# EAGLE design mspfacedraft2 (EAGLE 9.6.2)
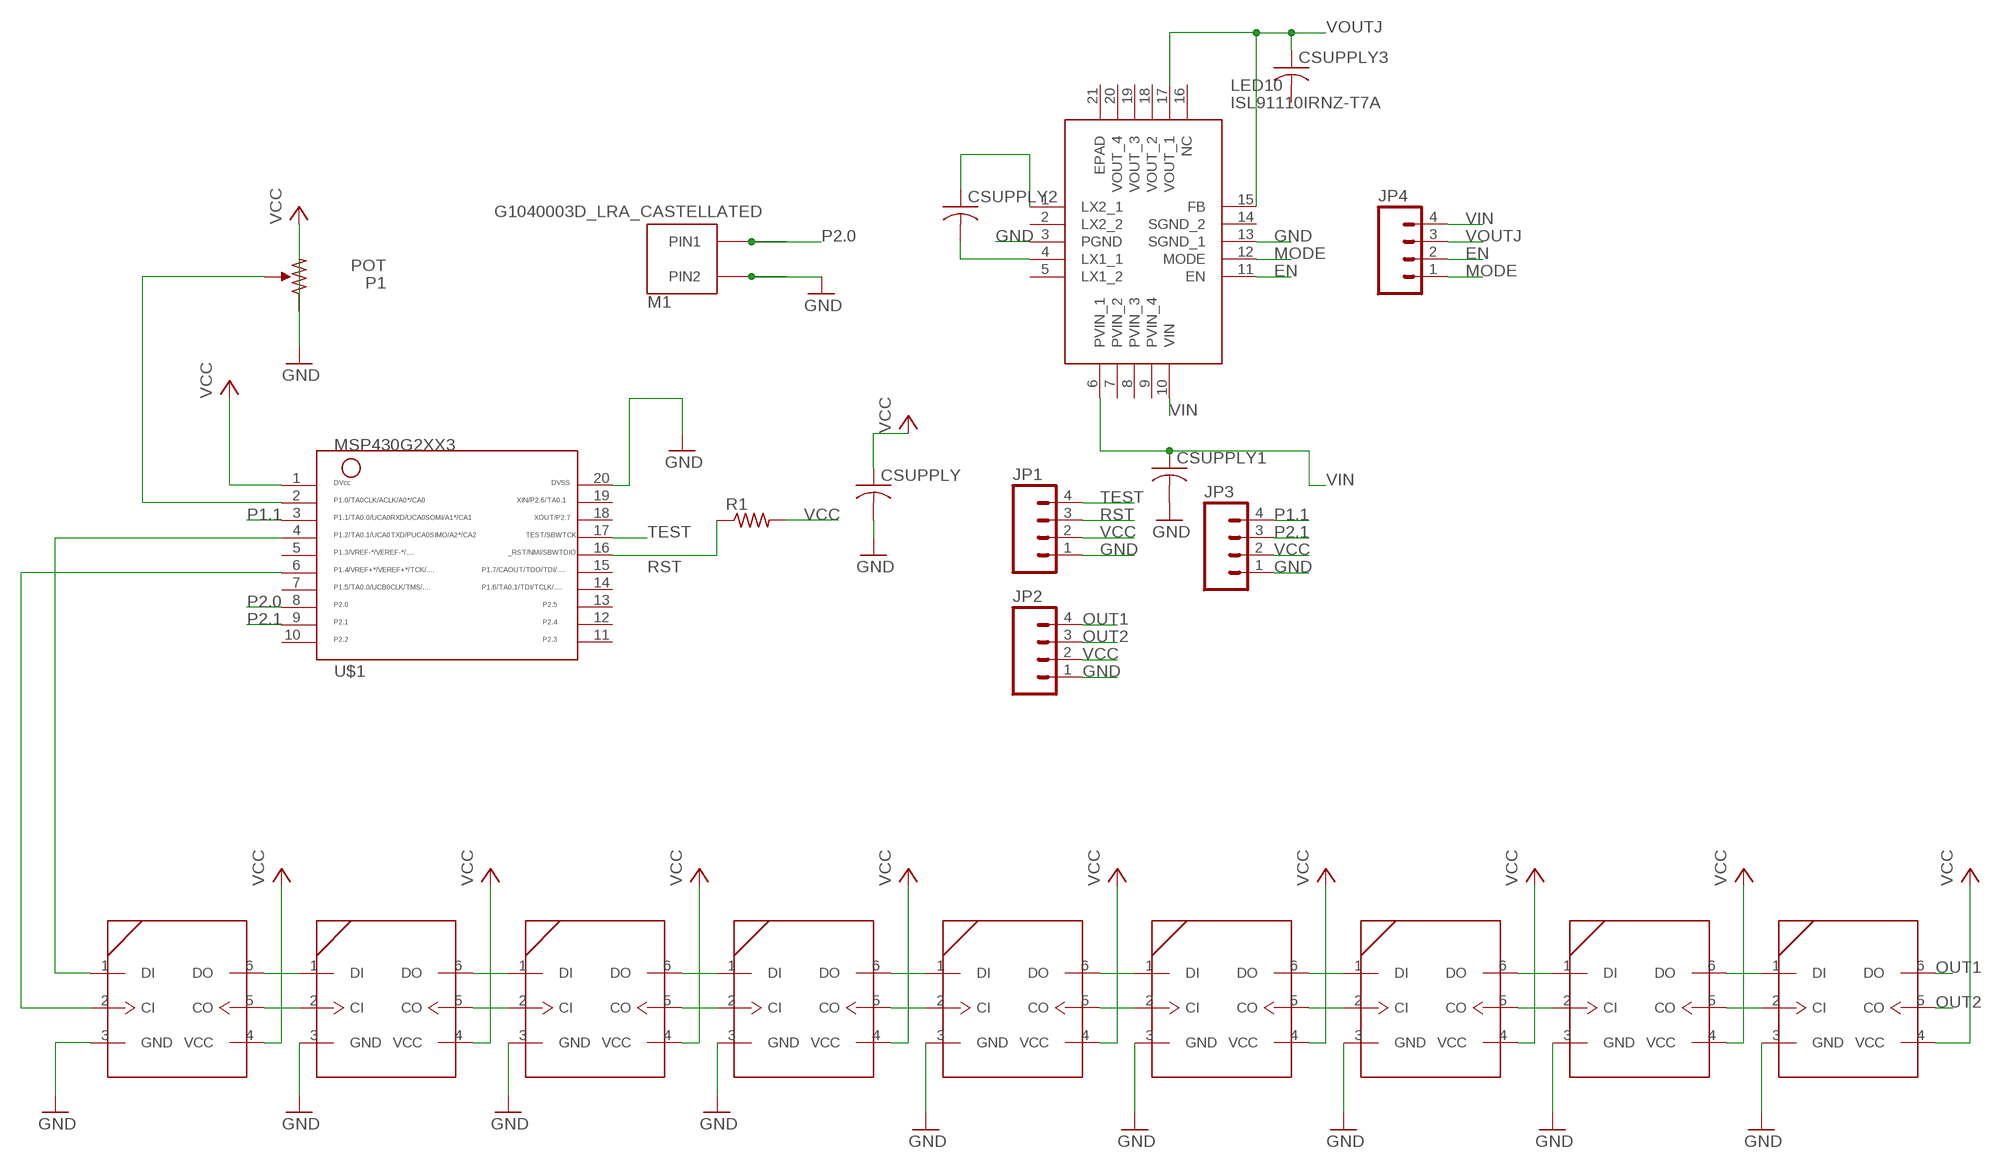
[diagram p0: schematic, sheet 1]

## Parts
CSUPPLY  C-USC1206  [C1206]
CSUPPLY1  C-USC1206  [C1206]
CSUPPLY2  C-USC1206  [C1206]
CSUPPLY3  C-USC1206  [C1206]
JP1  M04LOCK  [1X04_LOCK]
JP2  M04LOCK  [1X04_LOCK]
JP3  M04LOCK  [1X04_LOCK]
JP4  M04LOCK  [1X04_LOCK]
LED1  APA102  [5050]
LED2  APA102  [5050]
LED3  APA102  [5050]
LED4  APA102  [5050]
LED5  APA102  [5050]
LED6  APA102  [5050]
LED7  APA102  [5050]
LED8  APA102  [5050]
LED9  APA102  [5050]
LED10  ISL91110IRNZ-T7A  [QFN50P400X400X100-21N]
M1  G1040003D_LRA_CASTELLATED  [COIN_VIBRATION_MOTOR_CASTEL]
P1  POT  [POT]
R1  R-US_R1206  [R1206]
U$1  MSP430G2XX3TSSOP  [PW20]

## Nets
EN: JP4.2 LED10.11(EN)
GND: CSUPPLY1.2 CSUPPLY.2 JP1.1 JP2.1 JP3.1 LED1.3(GND) LED2.3(GND) LED3.3(GND) LED4.3(GND) LED5.3(GND) LED6.3(GND) LED7.3(GND) LED8.3(GND) LED9.3(GND) LED10.3(PGND) LED10.13(SGND_1) M1.P$2(PIN2) P1.GND(CW) U$1.20
MODE: JP4.1 LED10.12(MODE)
N$1: LED1.6(DO) LED2.1(DI)
N$2: LED1.5(CO) LED2.2(CI)
N$3: LED2.6(DO) LED3.1(DI)
N$4: LED2.5(CO) LED3.2(CI)
N$5: LED3.6(DO) LED4.1(DI)
N$6: LED3.5(CO) LED4.2(CI)
N$7: LED1.1(DI) U$1.4
N$8: LED1.2(CI) U$1.6
N$9: LED4.6(DO) LED5.1(DI)
N$10: LED4.5(CO) LED5.2(CI)
N$11: LED5.6(DO) LED6.1(DI)
N$12: LED5.5(CO) LED6.2(CI)
N$13: LED6.6(DO) LED7.1(DI)
N$14: LED6.5(CO) LED7.2(CI)
N$15: LED7.6(DO) LED8.1(DI)
N$16: LED7.5(CO) LED8.2(CI)
N$17: LED8.6(DO) LED9.1(DI)
N$18: LED8.5(CO) LED9.2(CI)
N$19: CSUPPLY2.2 LED10.4(LX1_1)
N$20: P1.SIG(S) U$1.2
N$21: CSUPPLY2.1 LED10.1(LX2_1)
OUT1: JP2.4 LED9.6(DO)
OUT2: JP2.3 LED9.5(CO)
P1.1: JP3.4 U$1.3
P2.0: M1.P$1(PIN1) U$1.8
P2.1: JP3.3 U$1.9
RST: JP1.3 R1.1 U$1.16
TEST: JP1.4 U$1.17
VCC: CSUPPLY.1 JP1.2 JP2.2 JP3.2 LED1.4(VCC) LED2.4(VCC) LED3.4(VCC) LED4.4(VCC) LED5.4(VCC) LED6.4(VCC) LED7.4(VCC) LED8.4(VCC) LED9.4(VCC) P1.VDD(CCW) R1.2 U$1.1
VIN: CSUPPLY1.1 JP4.4 LED10.6(PVIN_1) LED10.10(VIN)
VOUTJ: CSUPPLY3.1 JP4.3 LED10.15(FB) LED10.17(VOUT_1)
Unconnected: CSUPPLY3.2 LED10.2(LX2_2) LED10.5(LX1_2) LED10.7(PVIN_2) LED10.8(PVIN_3) LED10.9(PVIN_4) LED10.14(SGND_2) LED10.16(NC) LED10.18(VOUT_2) LED10.19(VOUT_3) LED10.20(VOUT_4) LED10.21(EPAD) U$1.5 U$1.7 U$1.10 U$1.11 U$1.12 U$1.13 U$1.14 U$1.15 U$1.18 U$1.19

## Library data of the parts
CSUPPLY CSUPPLY1-CSUPPLY3 = rcl:C-US: CAPACITOR, American symbol
JP1-JP4 = SparkFun:M04: Header 4 Standard 4-pin 0.1" header. Use with straight break away headers (SKU : PRT-00116), right angle break away headers (PRT-00553), swiss pins (PRT-00743), machine pins (PRT-00117), and female headers (PRT-00115). Molex polarized connector foot print use with SKU : PRT-08231 with associated crimp pins and housings. 1MM SMD Version SKU: PRT-10208
LED1-LED9 = ELEC327:APA102: APA102 SPI RGB LED APA102 is a chainable RGB LED. The control protocol is a variant of SPI.
LED10 = SamacSys_Parts:ISL91110IRNZ-T7A: Integrated FET Regulators High Current Buck Boost Switching Regulator Delivering 2A of Continuous Output Current Source: Datasheet <https://datasheet.datasheetarchive.com/originals/distributors/Datasheets_SAMA/d3e5c1b0a1d99c18e56c54f82b79d217.pdf>; DESCRIPTION: Integrated FET Regulators High Current Buck Boost Switching Regulator Delivering 2A of Continuous Output Current; HEIGHT: 1mm; MANUFACTURER_NAME: Renesas Electronics; MANUFACTURER_PART_NUMBER: ISL91110IRNZ-T7A; MOUSER_PART_NUMBER: 968-ISL91110IRNZ-T7A; MOUSER_PRICE-STOCK: https://www.mouser.co.uk/ProductDetail/Renesas-Intersil/ISL91110IRNZ-T7A?qs=vyIerDHf%2Fmmihws9YL5pdg%3D%3D
M1 = TEMP:G1040003D_LRA: G1040003D Coin Vibration Motor - Jinlong Machinery and Electronics Inc. LRA Coin Vibration Motor SparkFun Products: [PRODUCT 1] <[PRODUCT1LINK]>; PROD_ID: COMP-15536
P1 = pot:POT
R1 = resistor:R-US_: RESISTOR, American symbol
U$1 = ELEC327:MSP430G2XX3: MSP430G2XX3 PDIP (N) 20 Pin Package

## Board
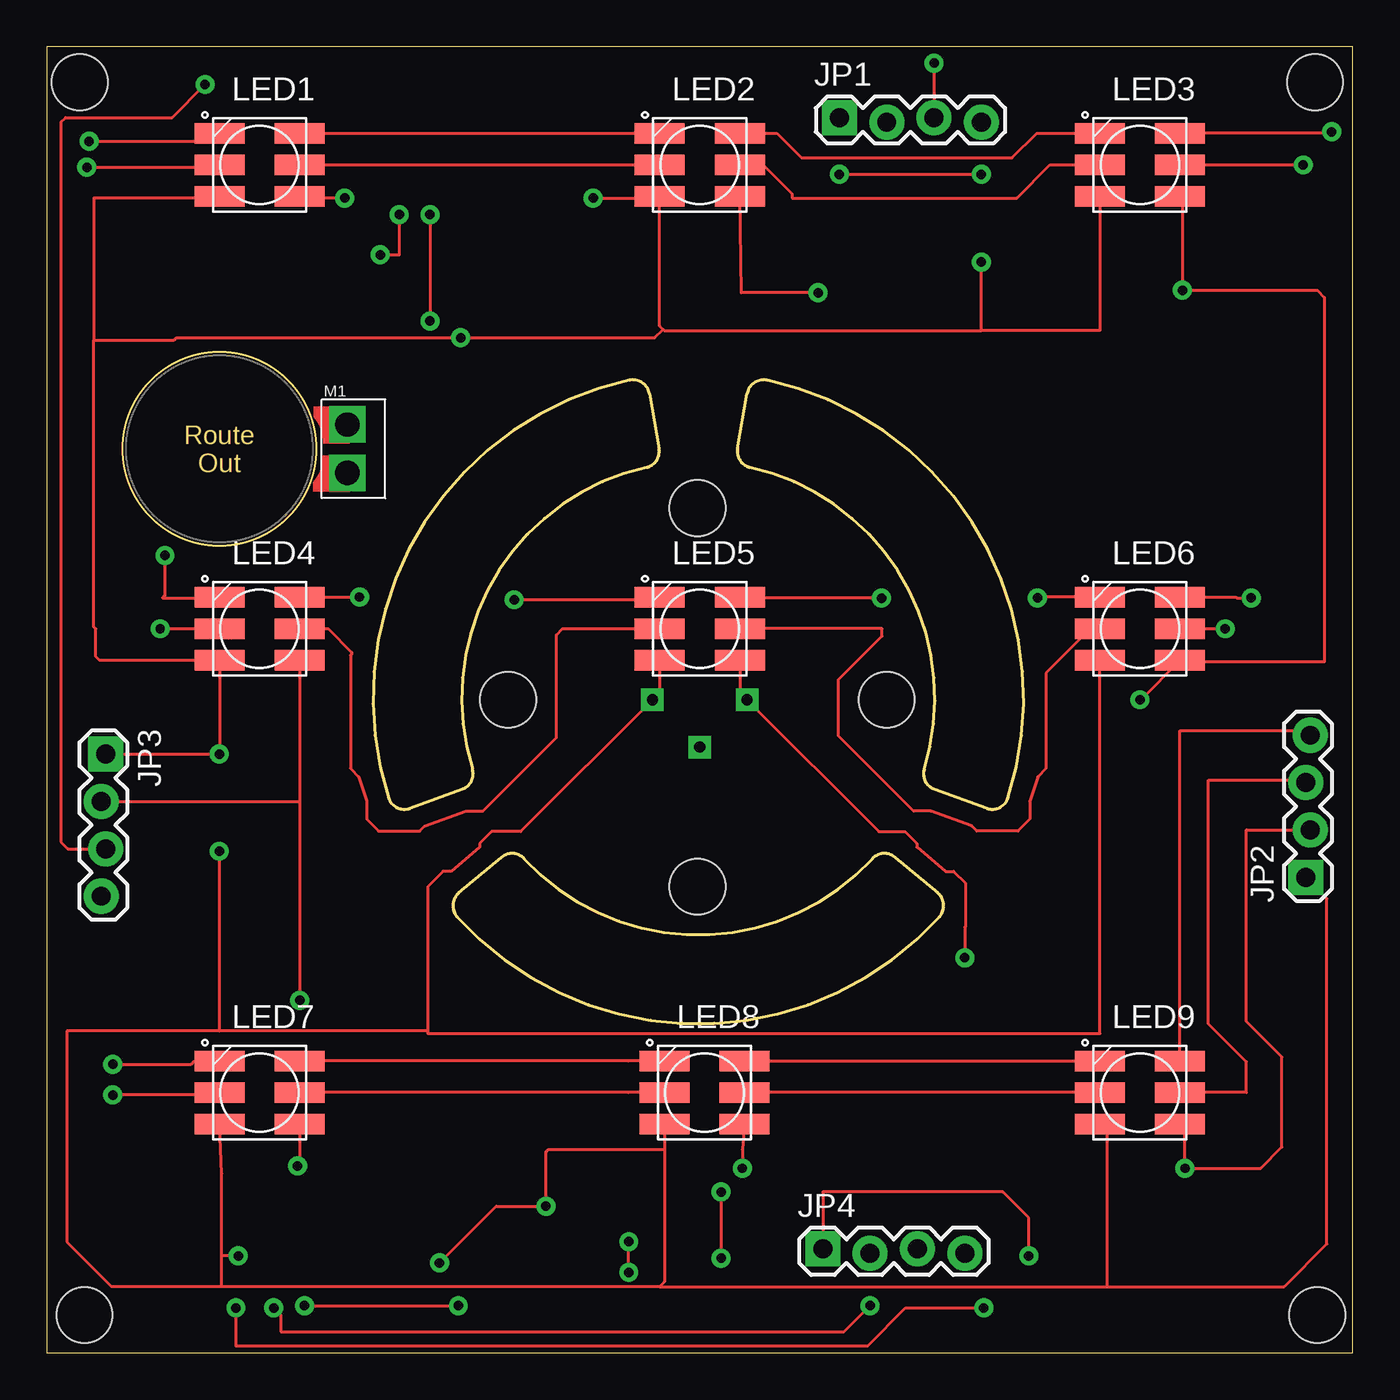
[diagram p1: board, top side]
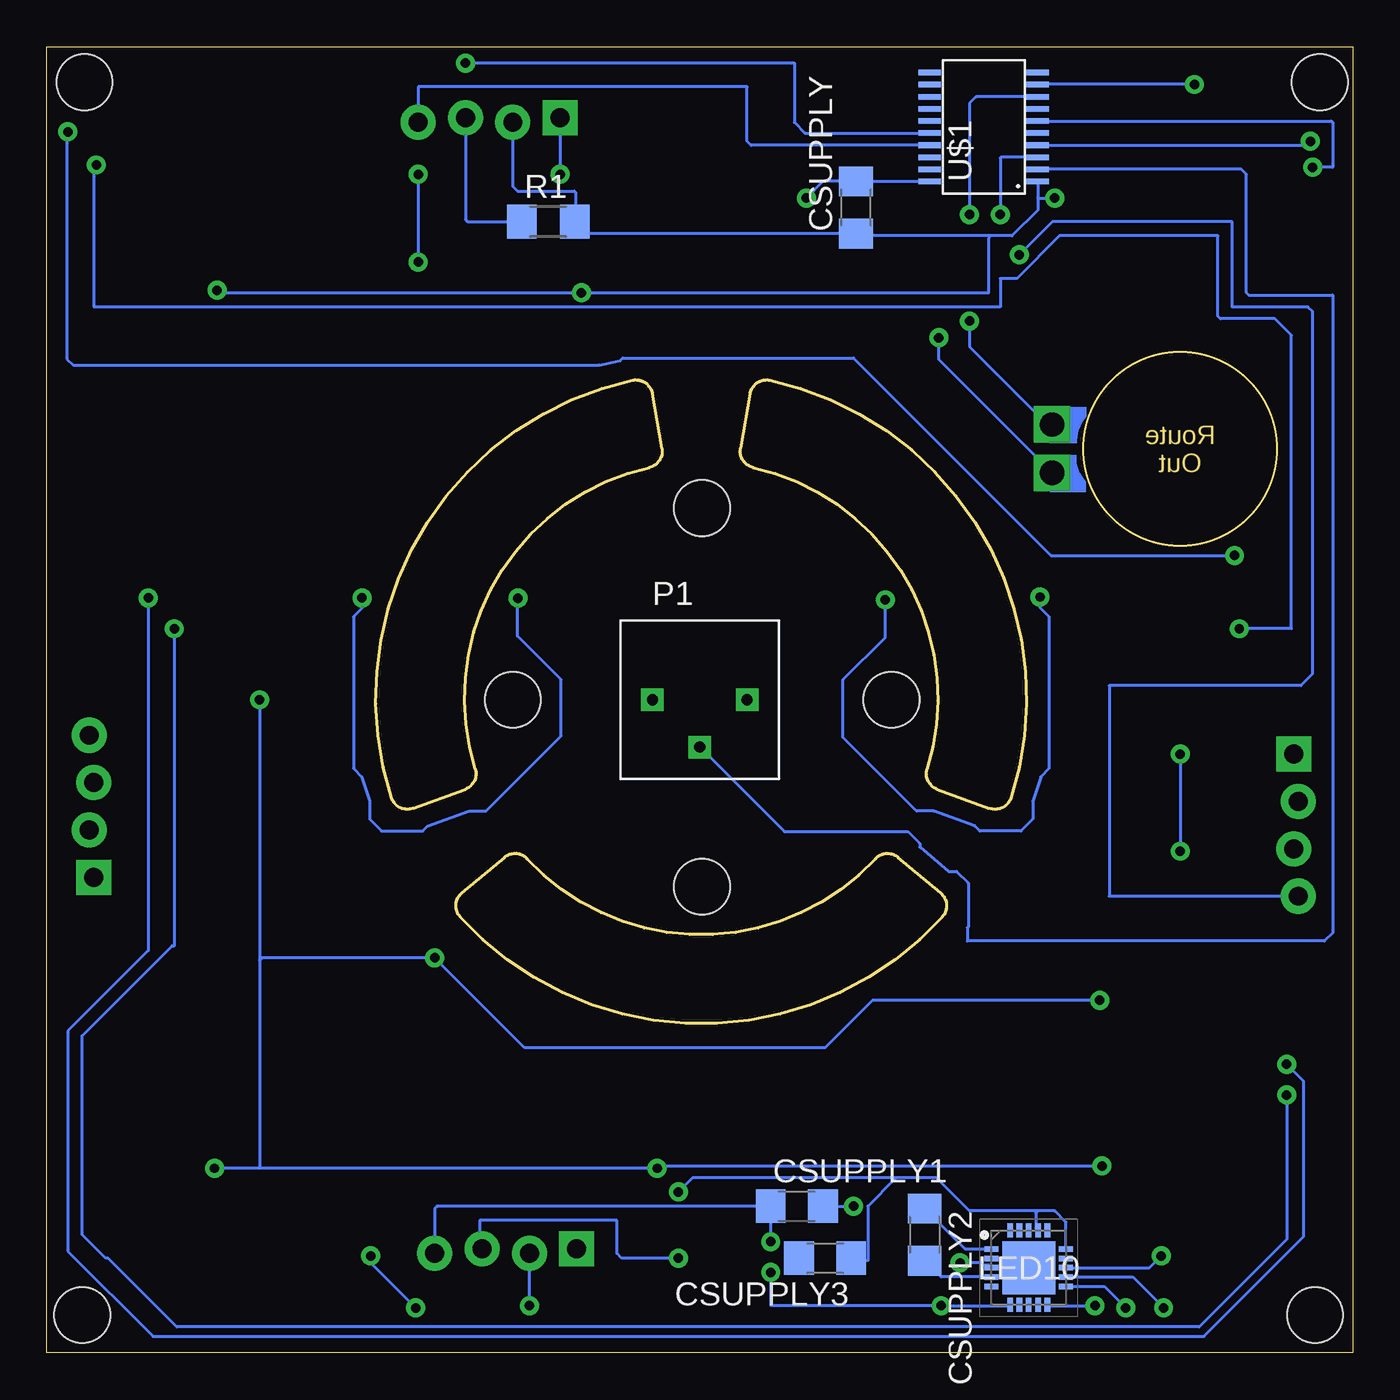
[diagram p2: board, bottom side, seen from below]

Size 70.1 x 70.1 mm. Coordinates in mm from the lower left corner, seen from the top.
Outline: 0,0 70.1,0 70.1,70.1 0,70.1 0,0
Outline: 50.45,29.23 arc92 51.6,29.79 arc96 38.66,52.2 arc92 37.6,51.48 37.08,48.54 arc87 37.76,47.52 arc-95 47.1,31.35 arc87 47.64,30.25 50.45,29.23
Outline: 32.35,51.48 arc92 31.28,52.2 arc96 18.35,29.79 arc92 19.5,29.23 22.3,30.25 arc87 22.85,31.35 arc-95 32.19,47.52 arc87 32.87,48.54 32.35,51.48
Outline: 22.12,24.68 arc92 22.04,23.4 arc96 47.91,23.4 arc92 47.82,24.68 45.53,26.6 arc87 44.31,26.52 arc-95 25.64,26.52 arc87 24.41,26.6 22.12,24.68
Copper layers (1*16): Top 0.035mm / dielectric 1.5mm / Bottom 0.035mm
Design rules "AdvancedCircuitsBarebones": minimum track width 6mil, minimum drill 20mil, track to track 6mil, track to pad 6mil, pad to pad 6mil, via to via 6mil, smd to smd 6mil, copper to edge 10mil, drill to drill 6mil, minimum pad ring 12mil, minimum via ring 10mil, stop-mask expansion 4mil, vias tented up to drill 25mil, thermal gap 10mil
Holes 3 mm at 34.92,25.02 24.77,35.05 34.92,45.34 45.09,35.05 68.07,68.2 1.78,68.2 2.03,2.03 68.2,2.03

### Footprints (pad centres in the part's own frame; a part is rotated, then mirrored left to right if it is on the bottom)
C1206 = smd 1.6 x 1.8: 1 -1.4,0; 2 1.4,0
1X04_LOCK = drill 1.016 pad 1.88 square: 1 0,0.127 | drill 1.016 pad 1.88: 2 2.54,-0.127; 3 5.08,0.127; 4 7.62,-0.127
5050 = smd 2.68 x 1.1: 1 -2.15,1.7; 2 -2.15,0; 3 -2.15,-1.7; 4 2.15,-1.7; 5 2.15,0; 6 2.15,1.7
QFN50P400X400X100-21N = smd 0.75 x 0.3: 1 -2,1; 2 -2,0.5; 3 -2,0; 4 -2,-0.5; 5 -2,-1; 11 2,-1; 12 2,-0.5; 13 2,0; 14 2,0.5; 15 2,1 | smd 0.3 x 0.75: 6 -1,-2; 7 -0.5,-2; 8 0,-2; 9 0.5,-2; 10 1,-2; 16 1,2; 17 0.5,2; 18 0,2; 19 -0.5,2; 20 -1,2 | smd 2.85 x 2.85: 21 0,0
COIN_VIBRATION_MOTOR_CASTEL = drill 1.3 square: P$1 6.87,1.31; P$2 6.87,-1.29
POT = drill 0.6 square: GND 2.54,0; SIG 0,-2.54; VDD -2.54,0
R1206 = smd 1.6 x 1.803: 1 -1.422,0; 2 1.422,0
PW20 = smd 0.3 x 1.2: 1 -2.925,-2.9; 2 -2.275,-2.9; 3 -1.625,-2.9; 4 -0.975,-2.9; 5 -0.325,-2.9; 6 0.325,-2.9; 7 0.975,-2.9; 8 1.625,-2.9; 9 2.275,-2.9; 10 2.925,-2.9; 11 2.925,2.9; 12 2.275,2.9; 13 1.625,2.9; 14 0.975,2.9; 15 0.325,2.9; 16 -0.325,2.9; 17 -0.975,2.9; 18 -1.625,2.9; 19 -2.275,2.9; 20 -2.925,2.9

### Placement (x,y rotation side)
CSUPPLY  26.67,61.47 90 bottom
CSUPPLY1  29.84,7.87 0 bottom
CSUPPLY2  22.99,6.35 270 bottom
CSUPPLY3  28.32,5.08 180 bottom
JP1  42.55,66.17 0 top
JP2  67.69,25.53 90 top
JP3  3.05,32.13 270 top
JP4  41.66,5.46 0 top
LED1  11.43,63.75 0 top
LED2  35.05,63.75 0 top
LED3  58.67,63.75 0 top
LED4  11.43,38.86 0 top
LED5  35.05,38.86 0 top
LED6  58.67,38.86 0 top
LED7  11.43,13.97 0 top
LED8  35.31,13.97 0 top
LED9  58.67,13.97 0 top
LED10  17.4,4.57 0 bottom
M1  9.27,48.51 0 top
P1  35.05,35.05 0 bottom
R1  43.18,60.71 0 bottom
U$1  19.81,65.79 90 bottom

### Tracks (layer width: path | path; a pad name or v marks a point on that pad's centre or on a via)
EN  (via drill 0.51)
  Top 0.152: v12.19,2.41 12.57,2.03 12.57,1.14 42.8,1.14 v44.2,2.54
  Bottom 0.152: LED10.11 13.35,3.57 v12.19,2.41 | v44.2,2.54 JP4.2
GND  (via drill 0.51)
  Top 0.152: LED1.3 9.22,61.98 2.54,61.98 2.54,54.36 | 50.16,54.86 33.15,54.86 33.08,54.93 | 32.89,3.56 9.4,3.56 | 9.4,3.56 3.5,3.56 1.09,5.97 1.09,17.27 9.27,17.27 | 9.4,3.56 9.4,5.21 | 9.4,5.21 9.4,9.61 LED7.3 | LED8.3 33.16,10.92 | 33.16,10.92 33.16,3.82 32.89,3.56 | 56.9,3.56 56.9,11.9 LED9.3 | 2.54,54.36 2.54,38.96 2.64,38.86 2.64,37.37 2.84,37.16 LED4.3 v9.28,32.14 v9.27,32.13 JP3.1 | LED5.3 32.9,35.44 P1.GND 25.44,27.98 23.88,27.98 23.24,27.34 23.24,27.14 21.7,25.85 21.28,25.85 20.45,25.02 20.45,17.27 | 32.89,3.56 56.9,3.56 | 56.9,3.56 66.42,3.56 68.71,5.84 68.71,24.38 JP2.1 | LED6.3 56.52,17.14 20.45,17.14 20.45,17.27 | 20.45,17.27 9.27,17.27 | 33.08,54.93 32.9,55.11 32.9,61.98 | 32.9,61.98 LED2.3 | v29.34,61.98 32.9,61.98 | v42.55,63.25 v50.16,63.25 | 50.16,54.86 v50.16,58.55 | LED3.3 56.52,54.87 56.52,54.86 50.16,54.86 | v9.27,26.92 9.27,17.27 | 2.54,54.36 6.84,54.36 6.96,54.48 v22.23,54.48 32.63,54.48 33.08,54.93 | 33.16,10.92 26.92,10.92 26.8,10.79 v26.8,7.87 24.13,7.87 v21.08,4.83 | v10.29,5.21 9.4,5.21
  Bottom 0.152: U$1.20 CSUPPLY.2 28.45,62.87 v29.34,61.98 | JP1.1 v42.55,63.25 | v50.16,63.25 v50.16,58.55 | v9.27,32.13 v9.27,26.92 | M1.P$2 22.23,53.31 v22.23,54.48 | CSUPPLY1.2 v26.8,7.87 | LED10.3 19.52,4.69 19.87,4.69 20,4.83 v21.08,4.83 | LED10.13 10.92,4.57 v10.29,5.21
MODE  (via drill 0.51)
  Top 0.152: v10.16,2.41 10.16,0.38 44.07,0.38 46.1,2.41 v50.29,2.41 | v52.7,5.21 52.7,7.24 51.31,8.64 41.66,8.64 JP4.1
  Bottom 0.152: LED10.12 11.82,4.07 v10.16,2.41 | v50.29,2.41 52.7,4.83 v52.7,5.21
N$1
  Top 0.152: LED1.6 LED2.1
N$2
  Top 0.152: LED1.5 LED2.2
N$3
  Top 0.152: LED2.6 39.19,65.45 40.51,64.14 51.82,64.14 53.13,65.45 LED3.1
N$4
  Top 0.152: LED2.5 38.46,63.75 40.01,62.2 40.01,61.98 52.07,61.98 53.85,63.75 LED3.2
N$5  (via drill 0.51)
  Top 0.152: v6.35,42.8 6.35,40.64 6.22,40.51 9.23,40.51 LED4.1 | v68.96,65.53 68.88,65.45 LED3.6
  Bottom 0.152: v68.96,65.53 69.01,65.53 69.01,53.34 68.68,53.01 40.43,53.01 39.33,53.25 39.19,53.39 26.79,53.39 16.2,42.8 v6.35,42.8
N$6  (via drill 0.51)
  Top 0.152: v6.1,38.86 LED4.2 | LED4.2 9.4,38.86 9.91,38.35 9.79,38.35 LED4.2 | LED3.5 v67.44,63.75
  Bottom 0.152: v67.44,63.75 67.56,63.75 67.56,56.13 18.92,56.13 18.92,57.66 18.03,57.66 15.75,59.94 7.24,59.94 7.24,55.63 7.11,55.5 4.19,55.5 3.3,54.61 3.3,38.86 v6.1,38.86
N$7  (via drill 0.51)
  Top 0.152: v2.29,65.02 8.95,65.02 LED1.1
  Bottom 0.152: U$1.4 2.5,64.81 v2.29,65.02
N$8  (via drill 0.51)
  Top 0.152: v2.16,63.63 9.15,63.63 LED1.2
  Bottom 0.152: U$1.6 1.16,66.11 1.09,66.04 1.09,63.63 v2.16,63.63
N$9  (via drill 0.51)
  Top 0.152: LED4.6 v16.79,40.56 | v25.09,40.42 32.76,40.42 LED5.1
  Bottom 0.152: v16.79,40.56 16.79,40 16.31,39.52 16.31,31.36 16.76,30.92 17.18,29.61 17.18,28.65 17.82,28.01 20.03,28.01 20.3,28.27 22.51,29.08 23.42,29.08 27.36,33.02 27.36,36.13 25.09,38.39 v25.09,40.42
N$10
  Top 0.152: LED4.5 15.11,38.86 16.38,37.59 16.38,37.5 16.31,37.43 16.31,31.36 16.76,30.92 17.18,29.61 17.18,28.65 17.82,28.01 20.03,28.01 20.3,28.27 22.51,29.08 23.42,29.08 27.36,33.02 27.36,38.53 27.69,38.86 LED5.2
N$11  (via drill 0.51)
  Top 0.152: LED6.1 53.22,40.56 v53.17,40.51 | v44.81,40.5 37.26,40.5 LED5.6
  Bottom 0.152: v53.17,40.51 53.17,39.98 53.63,39.52 53.63,31.36 53.19,30.92 52.77,29.61 52.77,28.65 52.13,28.01 49.92,28.01 49.65,28.27 47.44,29.08 46.53,29.08 42.49,33.12 42.49,36.13 44.83,38.46 44.83,40.51 44.82,40.51 v44.81,40.5
N$12
  Top 0.152: LED6.2 56.01,38.86 53.63,36.49 53.63,31.36 53.19,30.92 52.77,29.61 52.77,28.65 52.13,28.01 49.92,28.01 49.65,28.27 47.44,29.08 46.53,29.08 42.49,33.12 42.49,36.13 44.83,38.46 44.83,38.86 LED5.5
N$13  (via drill 0.51)
  Top 0.152: LED6.6 63.83,40.56 63.88,40.51 v64.64,40.51 | v3.56,15.49 7.75,15.49 7.92,15.67 LED7.1
  Bottom 0.152: v64.64,40.51 64.64,21.59 68.96,17.27 68.96,5.46 64.39,0.89 8,0.89 2.67,6.22 2.67,14.61 v3.56,15.49
N$14  (via drill 0.51)
  Top 0.152: v3.56,13.84 9.28,13.84 LED7.2 | LED6.5 v63.25,38.86
  Bottom 0.152: v63.25,38.86 63.25,21.84 63.37,21.84 68.2,17.02 68.2,6.35 66.93,5.08 66.8,5.08 63.12,1.4 8.26,1.4 3.56,6.1 v3.56,13.84
N$15
  Top 0.152: LED8.1 31.22,15.67 LED7.6
N$16
  Top 0.152: LED8.2 31.22,13.97 LED7.5
N$17
  Top 0.152: LED8.6 LED9.1
N$18
  Top 0.152: LED9.2 LED8.5
N$19
  Bottom 0.152: LED10.4 22.11,4.07 CSUPPLY2.2
N$20
  Bottom 0.152: P1.SIG 30.52,27.98 23.88,27.98 23.24,27.34 23.24,27.14 21.7,25.85 21.28,25.85 20.64,25.21 20.64,22.87 20.7,22.81 20.7,22.1 1.52,22.1 1.09,22.53 1.09,56.77 5.59,56.77 5.71,56.9 5.71,63.25 5.98,63.51 U$1.2
N$21
  Bottom 0.152: LED10.1 20.81,5.57 CSUPPLY2.1
OUT1
  Top 0.152: LED9.6 60.82,33.39 60.83,33.4 66.93,33.4 67.31,33.02 67.69,33.02 JP2.4
OUT2
  Top 0.152: JP2.3 67.94,30.61 68.07,30.73 62.36,30.73 62.36,17.65 64.39,15.62 64.39,13.97 LED9.5
P1.1  (via drill 0.51)
  Top 0.152: v18.92,61.09 18.92,58.93 v17.91,58.93
  Bottom 0.152: U$1.3 18.9,64.16 18.92,64.14 v18.92,61.09 | JP3.4 13.08,24.51 13.08,35.81 2.79,35.81 2.16,36.45 2.16,55.88 2.41,56.13 6.48,56.13 6.48,60.71 16.13,60.71 v17.91,58.93
P2.0  (via drill 0.51)
  Top 0.152: v20.57,61.09 v20.57,55.37
  Bottom 0.152: U$1.8 20.22,67.41 20.57,67.06 v20.57,61.09 | v20.57,55.37 20.57,54 16.39,49.82 M1.P$1
P2.1  (via drill 0.51)
  Top 0.152: JP3.3 1.14,27.05 0.76,27.43 0.76,66.04 1.02,66.29 6.73,66.29 v8.51,68.07
  Bottom 0.152: v8.51,68.07 16.9,68.07 U$1.9
RST  (via drill 0.51)
  Top 0.152: v47.62,69.22 JP1.3
  Bottom 0.152: U$1.16 29.39,65.46 29.97,66.04 29.97,69.22 v47.62,69.22 | R1.1 47.5,60.71 47.62,60.83 JP1.3
TEST
  Bottom 0.152: U$1.17 32.3,64.81 32.51,65.02 32.51,67.94 50.16,67.94 JP1.4
VCC  (via drill 0.51)
  Top 0.152: LED8.4 37.34,10.92 v37.34,9.91 | v58.67,35.05 58.71,35.05 LED6.4 60.9,37.08 68.58,37.08 68.58,56.64 68.2,57.02 v60.96,57.02 60.96,61.92 LED3.4 | JP2.2 64.39,28.07 64.39,17.78 66.29,15.88 66.29,11.05 65.15,9.91 v61.09,9.91 61.09,12.01 LED9.4 | LED5.4 37.2,35.44 P1.VDD 44.67,27.98 46.06,27.98 46.7,27.34 46.7,27.14 48.25,25.85 48.67,25.85 49.31,25.21 49.31,22.87 49.28,22.84 v49.28,21.21 | LED4.4 13.58,29.59 | 13.58,29.59 13.58,18.93 v13.59,18.92 | v41.4,56.9 37.28,56.9 LED2.4 | JP3.2 13.58,29.59 | LED7.4 13.58,10.15 v13.46,10.03 | v16,61.98 13.66,61.98 LED1.4
  Bottom 0.152: 19.43,59.94 18.29,59.94 16.91,61.32 16.91,61.98 | 19.43,59.94 26.55,59.94 CSUPPLY.1 41.12,60.07 41.71,60.66 | v13.46,10.03 37.21,10.03 v37.34,9.91 58.67,9.91 | v58.67,35.05 58.67,21.08 | 58.67,21.08 58.67,9.91 | 58.67,21.08 58.55,21.21 v49.28,21.21 44.44,16.37 28.33,16.37 25.78,18.92 v13.59,18.92 | v60.96,57.02 60.83,56.9 v41.4,56.9 19.56,56.9 19.56,59.82 19.43,59.94 | 41.71,60.66 R1.2 | U$1.1 16.91,61.98 | JP1.2 45.09,62.61 44.83,62.36 41.78,62.36 41.71,62.28 41.71,60.66 | 58.67,9.91 v61.09,9.91 | 16.91,61.98 v16,61.98
VIN  (via drill 0.51)
  Top 0.152: v13.84,2.54 v22.1,2.54 | v31.24,4.32 v31.24,5.97
  Bottom 0.152: LED10.10 16.37,2.54 v13.84,2.54 | LED10.6 18.43,2.54 v22.1,2.54 31.24,2.54 v31.24,4.32 | v31.24,5.97 CSUPPLY1.1 49.15,7.87 49.28,7.75 JP4.4
VOUTJ  (via drill 0.51)
  Top 0.152: v36.2,8.64 v36.2,5.08
  Bottom 0.152: JP4.3 46.86,5.71 46.86,7.11 39.5,7.11 39.5,5.33 39.24,5.08 v36.2,5.08 | LED10.15 15.4,7.02 16,7.62 16.89,7.62 | 16.89,7.62 17.02,7.49 17.02,6.69 LED10.17 | 24.51,9.4 22.35,9.4 20.57,7.62 16.89,7.62 | CSUPPLY3.1 26.79,4.95 26.04,4.95 26.04,7.87 24.51,9.4 | 24.51,9.4 35.43,9.4 v36.2,8.64

### Text on the board
Document: RUBIKS TEAM